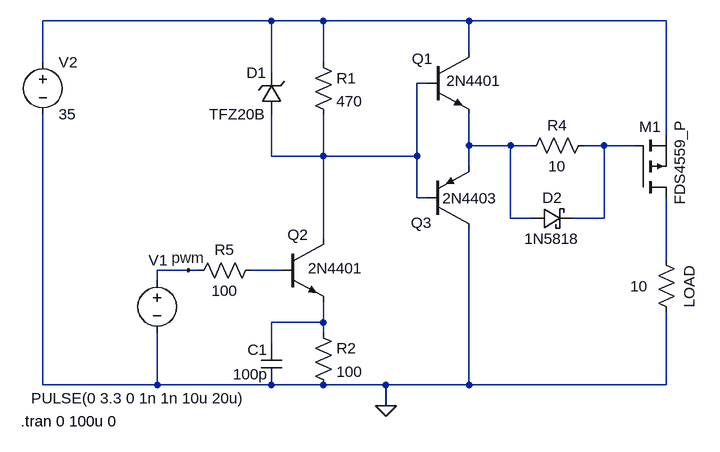
[diagram p0: schematic High_Side_P_Channel_Driver.asc]
High_Side_P_Channel_Driver.asc, the LTspice schematic file:
Version 4
SHEET 1 884 696
WIRE 0 -32 -352 -32
WIRE 80 -32 0 -32
WIRE 304 -32 80 -32
WIRE 608 -32 304 -32
WIRE 304 16 304 -32
WIRE -352 32 -352 -32
WIRE 80 32 80 -32
WIRE 0 48 0 -32
WIRE 240 64 224 64
WIRE 608 144 608 -32
WIRE 304 160 304 112
WIRE 368 160 304 160
WIRE 400 160 368 160
WIRE 512 160 480 160
WIRE 560 160 512 160
WIRE 0 176 0 112
WIRE 80 176 80 112
WIRE 80 176 0 176
WIRE 224 176 224 64
WIRE 224 176 80 176
WIRE 304 192 304 160
WIRE 224 240 224 176
WIRE 240 240 224 240
WIRE 368 272 368 160
WIRE 400 272 368 272
WIRE 512 272 512 160
WIRE 512 272 464 272
WIRE 80 304 80 176
WIRE 608 336 608 240
WIRE -128 352 -176 352
WIRE -112 352 -128 352
WIRE 16 352 -32 352
WIRE -176 368 -176 352
WIRE 80 432 80 400
WIRE 80 432 0 432
WIRE 80 448 80 432
WIRE 0 464 0 432
WIRE -352 528 -352 112
WIRE -176 528 -176 448
WIRE -176 528 -352 528
WIRE 0 528 -176 528
WIRE 80 528 0 528
WIRE 176 528 80 528
WIRE 304 528 304 288
WIRE 304 528 176 528
WIRE 608 528 608 416
WIRE 608 528 304 528
WIRE 176 560 176 528
FLAG 176 560 0
FLAG -128 352 pwm
SYMBOL npn 240 16 R0
WINDOW 0 -24 10 Left 2
WINDOW 3 29 44 Left 2
SYMATTR InstName Q1
SYMATTR Value 2N4401
SYMBOL npn 16 304 R0
WINDOW 0 9 -7 Left 2
WINDOW 3 40 45 Left 2
SYMATTR InstName Q2
SYMATTR Value 2N4401
SYMBOL pnp 240 288 M180
WINDOW 0 -25 9 Left 2
WINDOW 3 23 47 Left 2
SYMATTR InstName Q3
SYMATTR Value 2N4403
SYMBOL res 64 16 R0
SYMATTR InstName R1
SYMATTR Value 470
SYMBOL res 64 432 R0
SYMATTR InstName R2
SYMATTR Value 100
SYMBOL cap -16 464 R0
WINDOW 0 -21 10 Left 2
WINDOW 3 -43 48 Left 2
SYMATTR InstName C1
SYMATTR Value 100p
SYMBOL pmos 560 240 M180
WINDOW 0 6 109 Left 2
WINDOW 3 69 120 VLeft 2
SYMATTR InstName M1
SYMATTR Value FDS4559_P
SYMBOL voltage -176 352 R0
WINDOW 0 -13 -16 Left 2
WINDOW 3 -194 197 Left 2
WINDOW 123 0 0 Left 2
WINDOW 39 0 0 Left 2
SYMATTR InstName V1
SYMATTR Value PULSE(0 3.3 0 1n 1n 10u 20u)
SYMBOL voltage -352 16 R0
WINDOW 123 0 0 Left 2
WINDOW 39 0 0 Left 2
SYMATTR InstName V2
SYMATTR Value 35
SYMBOL res 592 320 R0
WINDOW 0 51 25 VRight 2
WINDOW 3 -40 56 Left 2
SYMATTR InstName LOAD
SYMATTR Value 10
SYMBOL zener 16 112 R180
WINDOW 0 24 64 Left 2
WINDOW 3 24 0 Left 2
SYMATTR InstName D1
SYMATTR Value TFZ20B
SYMBOL res 496 144 R90
WINDOW 0 0 56 VBottom 2
WINDOW 3 32 56 VTop 2
SYMATTR InstName R4
SYMATTR Value 10
SYMBOL schottky 400 288 R270
WINDOW 0 32 32 VTop 2
WINDOW 3 0 32 VBottom 2
SYMATTR InstName D2
SYMATTR Value 1N5818
SYMATTR Description Diode
SYMATTR Type diode
SYMBOL res -16 336 R90
WINDOW 0 0 56 VBottom 2
WINDOW 3 32 56 VTop 2
SYMATTR InstName R5
SYMATTR Value 100
TEXT -386 584 Left 2 !.tran 0 100u 0

The netlist it stands for:
* High_Side_P_Channel_Driver.asc
Q1 N001 N002 N003 0 2N4401
Q2 N002 N006 N007 0 2N4401
Q3 0 N002 N003 0 2N4403
R1 N001 N002 470
R2 N007 0 100
C1 N007 0 100p
M1 N005 N004 N001 N001 FDS4559_P
V1 pwm 0 PULSE(0 3.3 0 1n 1n 10u 20u)
V2 N001 0 35
R§LOAD N005 0 10
D1 N002 N001 TFZ20B
R4 N004 N003 10
D2 N003 N004 1N5818
R5 N006 pwm 100
.model D D
.lib standard.dio
.model NPN NPN
.model PNP PNP
.lib standard.bjt
.model NMOS NMOS
.model PMOS PMOS
.lib standard.mos
.tran 0 100u 0
.backanno
.end